# Altium schematic sheet Inductor 10uH.schdoc
size 127 x 99 mm
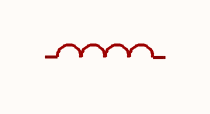
[diagram p0: Inductor 10uH.schdoc]

## Parts
L?  LPS4018-103MRC  [IND-SMD_L3.9-W3.9-1]  (value not drawn)

## Nets

Not connected (* = marked no-connect by the designer): L? 1 2

## Library data of the parts
L? = LPS4018-103MRC: Manufacturer: Coilcraft(线艺); Add into BOM: yes; Symbol: LPS4018-103MRC; Device: LPS4018-103MRC; LCSC Part Name: LPS4018-103MRC; Supplier Part: C6127589; Manufacturer Part: LPS4018-103MRC; Supplier Footprint: SMD,3.9x3.9mm; JLCPCB Part Class: Extended Part; Datasheet: https://atta.szlcsc.com/upload/public/pdf/source/20220705/4A26DAB81CB6B332CC15AA1D7F647266.pdf; Supplier: LCSC; Convert to PCB: yes